# Altium schematic sheet USB.SchDoc
size A4; ApprovedBy: Krzysztof Belewicz; CheckedBy: Krzysztof Belewicz; Author: Krzysztof Belewicz; CompanyName: Koło Naukowe Systemów Scalonych; DrawnBy: Krzysztof Belewicz; Organization: KNSS; Address1: Koło Naukowe; Address2: Systemów Scalonych; Address3: 00-665 Warszawa; Address4: Nowowiejska 15/19; DocumentNumber: 2; Revision: 1.0; SheetNumber: 2; SheetTotal: 2
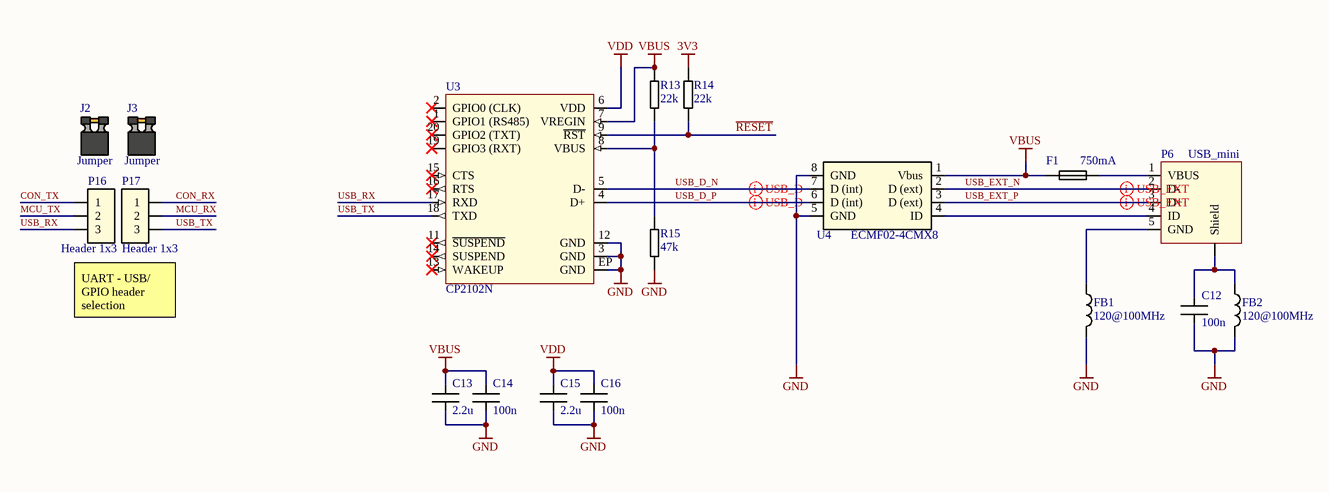
[diagram p0: USB.SchDoc]

## Parts
C12  100n  [CAPC1005N]
C13  value 2.2u  [CAPC1005N]  (hidden comment: Capacitor)
C14  100n  [CAPC1005N]
C15  value 2.2u  [CAPC1005N]  (hidden comment: Capacitor)
C16  100n  [CAPC1005N]
F1  Stand Current: 750mA  [RESC2012N]  (hidden comment: PTC Fuse)
FB1  120@100MHz  [INDC1005N]
FB2  120@100MHz  [INDC1005N]
J2  Jumper  [JUMPER-B]
J3  Jumper  [JUMPER-B]
P6  USB_mini  [MUSB-B5-S-RA-TSMT-CS1]
P16  Header 1x3  [Header 1x3, Male, 2.54mm, Straight, THT]
P17  Header 1x3  [Header 1x3, Male, 2.54mm, Straight, THT]
R13  value 22k  [RESC1005N]  (hidden comment: Resistor)
R14  value 22k  [RESC1005N]  (hidden comment: Resistor)
R15  value 47k  [RESC1005N]  (hidden comment: Resistor)
U3  CP2102N  [QFN-20]
U4  ECMF02-4CMX8  [uQFN-8]

## Nets
3V3: R14.2
GND: C12.1 C13.1 C14.1 C15.1 C16.1 FB1.2 FB2.2 R15.1 U3.3(GND) U3.12(GND) U3.EP(GND) U4.5(GND) U4.8(GND)
VBUS: C13.2 C14.2 F1.1 R13.2 U3.7(VREGIN) U4.1(Vbus)
VDD: C15.2 C16.2 U3.6(VDD)
CON_RX: P17.1
CON_TX: P16.1
MCU_RX: P17.2
MCU_TX: P16.2
~{RESET}: R14.1 U3.9(~{RST})
USB_D_N: U3.5(D-) U4.7(D_(int))
USB_D_P: U3.4(D+) U4.6(D_(int))
USB_EXT_N: P6.2(D-) U4.2(D_(ext))
USB_EXT_P: P6.3(D+) U4.3(D_(ext))
USB_RX: P16.3 U3.17(RXD)
USB_TX: P17.3 U3.18(TXD)
NetC12_2: C12.2 FB2.1 P6.0(Shield)
NetF1_2: F1.2 P6.1(VBUS)
NetFB1_1: FB1.1 P6.5(GND)
NetP6_4: P6.4(ID) U4.4(ID)
NetR13_1: R13.1 R15.2 U3.8(VBUS)

Not connected (* = marked no-connect by the designer): U3 1(GPIO1_(RS485))* 2(GPIO0_(CLK))* 11(~{SUSPEND})* 13(WAKEUP)* 14(SUSPEND)* 15(CTS)* 16(RTS)* 19(GPIO3_(RXT))* 20(GPIO2_(TXT))*

## Layout directives
differential pair; rule Differential Pairs Routing [Pref Gap = 12mil    Min Gap  = 6mil    Max Gap  = 20milPref Width = 12mil    Min Width  = 6mil    Max Width  = 15mil]: USB_D_N, USB_D_P, USB_EXT_N, USB_EXT_P

## Notes on the sheet
- UART - USB/ GPIO header selection
- Project:
- Variant:
- File:
- Sheet:
- Revision:
- Total Sheet:
- Author:
- Modified:

## Library data of the parts
C12 C14 C16 = Capacitor: 0402 SMD Capacitor; Manufacturer Part Number 1: CL05B104KO5NNNC; Manufacturer 1: Samsung; Tolerance: 10%; MaxVoltage: 16V; Supplier 1: TME; Supplier 2: Farnell; Value: 100n; Supplier Part Number 1: CL05B104KO5NNNC; Manufacturer 2: Multicomp; Manufacturer Part Number 2: MC0402B104K100CT; Supplier Part Number 2: 2627343
C13 C15 = Capacitor: 0402 SMD Capacitor; Manufacturer 1: MURATA; Manufacturer Part Number 1: GRM155R60J225ME95D; Tolerance: 10%; MaxVoltage: 6.3V; Supplier 1: Farnell; Supplier Part Number 1: 2362091; Manufacturer Part Number 2: GRT155C80J225KE01D; Manufacturer 2: MURATA; Supplier Part Number 2: 2672104; Supplier 2: Farnell
F1 = SD075-16: PTC Fuse 750mA; Manufacturer 1: ECE; Manufacturer Part Number 1: SR075-06; Max Voltage: 6V; Supplier 1: TME; Supplier Part Number 1: SR075-06
FB1 FB2 = Inductor: Ferrite Bead; Manufacturer 1: Murata; Manufacturer Part Number 1: BLM15PD121SN1D; Max Current: 1.3A; Tolerance: 25%; Supplier 1: TME; Value: 120@100MHz; Supplier Part Number 1: BLM15PD121SN1D; Manufacturer 2: Murata; Manufacturer Part Number 2: BLM15PD121SN1D; Supplier Part Number 2: 2443229; Supplier 2: Farnell
J2 J3 = Header Jumper Black: 1x2, 2.54mm Black header jumper; Manufacturer 1: Multicomp; Manufacturer Part Number 1: MC-2228CG; Supplier 1: Farnell; SMD: No; Supplier Part Number 1: 2834673; Socket: No; Pin count: 0; Supplier 2: TME; Supplier Part Number 2: JUMPER-B; Manufacturer 2: NINIGI; Manufacturer Part Number 2: JUMPER-B
P6 = MUSB-B5-S-RA-TSMT-CS1: Gniazdo; USB B mini; SMT; poziome; V: USB 2.0; złocony; Manufacturer 1: ADAM TECH; Supplier 1: TME; Supplier Part Number 1: MUSB-B5-S-RA-SMT; Manufacturer Part Number 1: MUSB-B5-S-RA-TSMT-CS1; SMD: Yes; Socket: No; Pin count: 5
P16 P17 = Header 1x3: Pin header, 1x3, 2.54mm; Manufacturer 1: CONNFLY; Manufacturer Part Number 1: DS1021-1*3SF1-1; Supplier Part Number 1: ZL201-03G; Supplier 1: TME
R13 R14 = Resistor: 0402 Film SMD Resistor; Manufacturer 1: TE CONNECTIVITY; Manufacturer Part Number 1: CRGCQ0402F22K; Tolerance: 1%; Power: 0.1W; Supplier 1: Farnell; Supplier Part Number 1: 2861416; Manufacturer Part Number 2: CRCW040222K0FKTDBC; Manufacturer 2: VISHAY; Supplier 2: TME; Supplier Part Number 2: CRCW040222K0FKTDBC
R15 = Resistor: 0402 Film SMD Resistor; Manufacturer 1: MULTICOMP; Manufacturer Part Number 1: MCWR04X4702FTL; Tolerance: 1%; Power: 0.1W; Supplier 1: Farnell; Supplier Part Number 1: 2447179; Manufacturer Part Number 2: 0402WGF4702TCE; Manufacturer 2: ROYAL OHM; Supplier 2: TME; Supplier Part Number 2: SMD0402-47K-1%
U3 = CP2102N: USB Interface IC USBXpress - USB to UART Bridge QFN20; Manufacturer Part Number 1: CP2102N-A01-GQFN20; Manufacturer 1: SILICON LABS; Manufacturer Part Number 2: CP2102N-A01-GQFN20; Supplier 1: Farnell; Supplier 2: Mouser; Supplier Part Number 1: 2577277; Manufacturer 2: SILICON LABS; Supplier Part Number 2: 634-CP2102NA01GQFN20; Pin count: 20; SMD: Yes; Socket: No
U4 = ECMF02-4CMX8: STMicroelectronics Common Mode Filter with ESD protection, USB compatible; Supplier 1: Farnell; Supplier Part Number 1: 2629721; Manufacturer 1: STMicroelectronics; Manufacturer Part Number 1: ECMF02-4CMX8